# Altium schematic sheet Mixer.SchDoc
size B; SheetNumber: 3; SheetTotal: 8
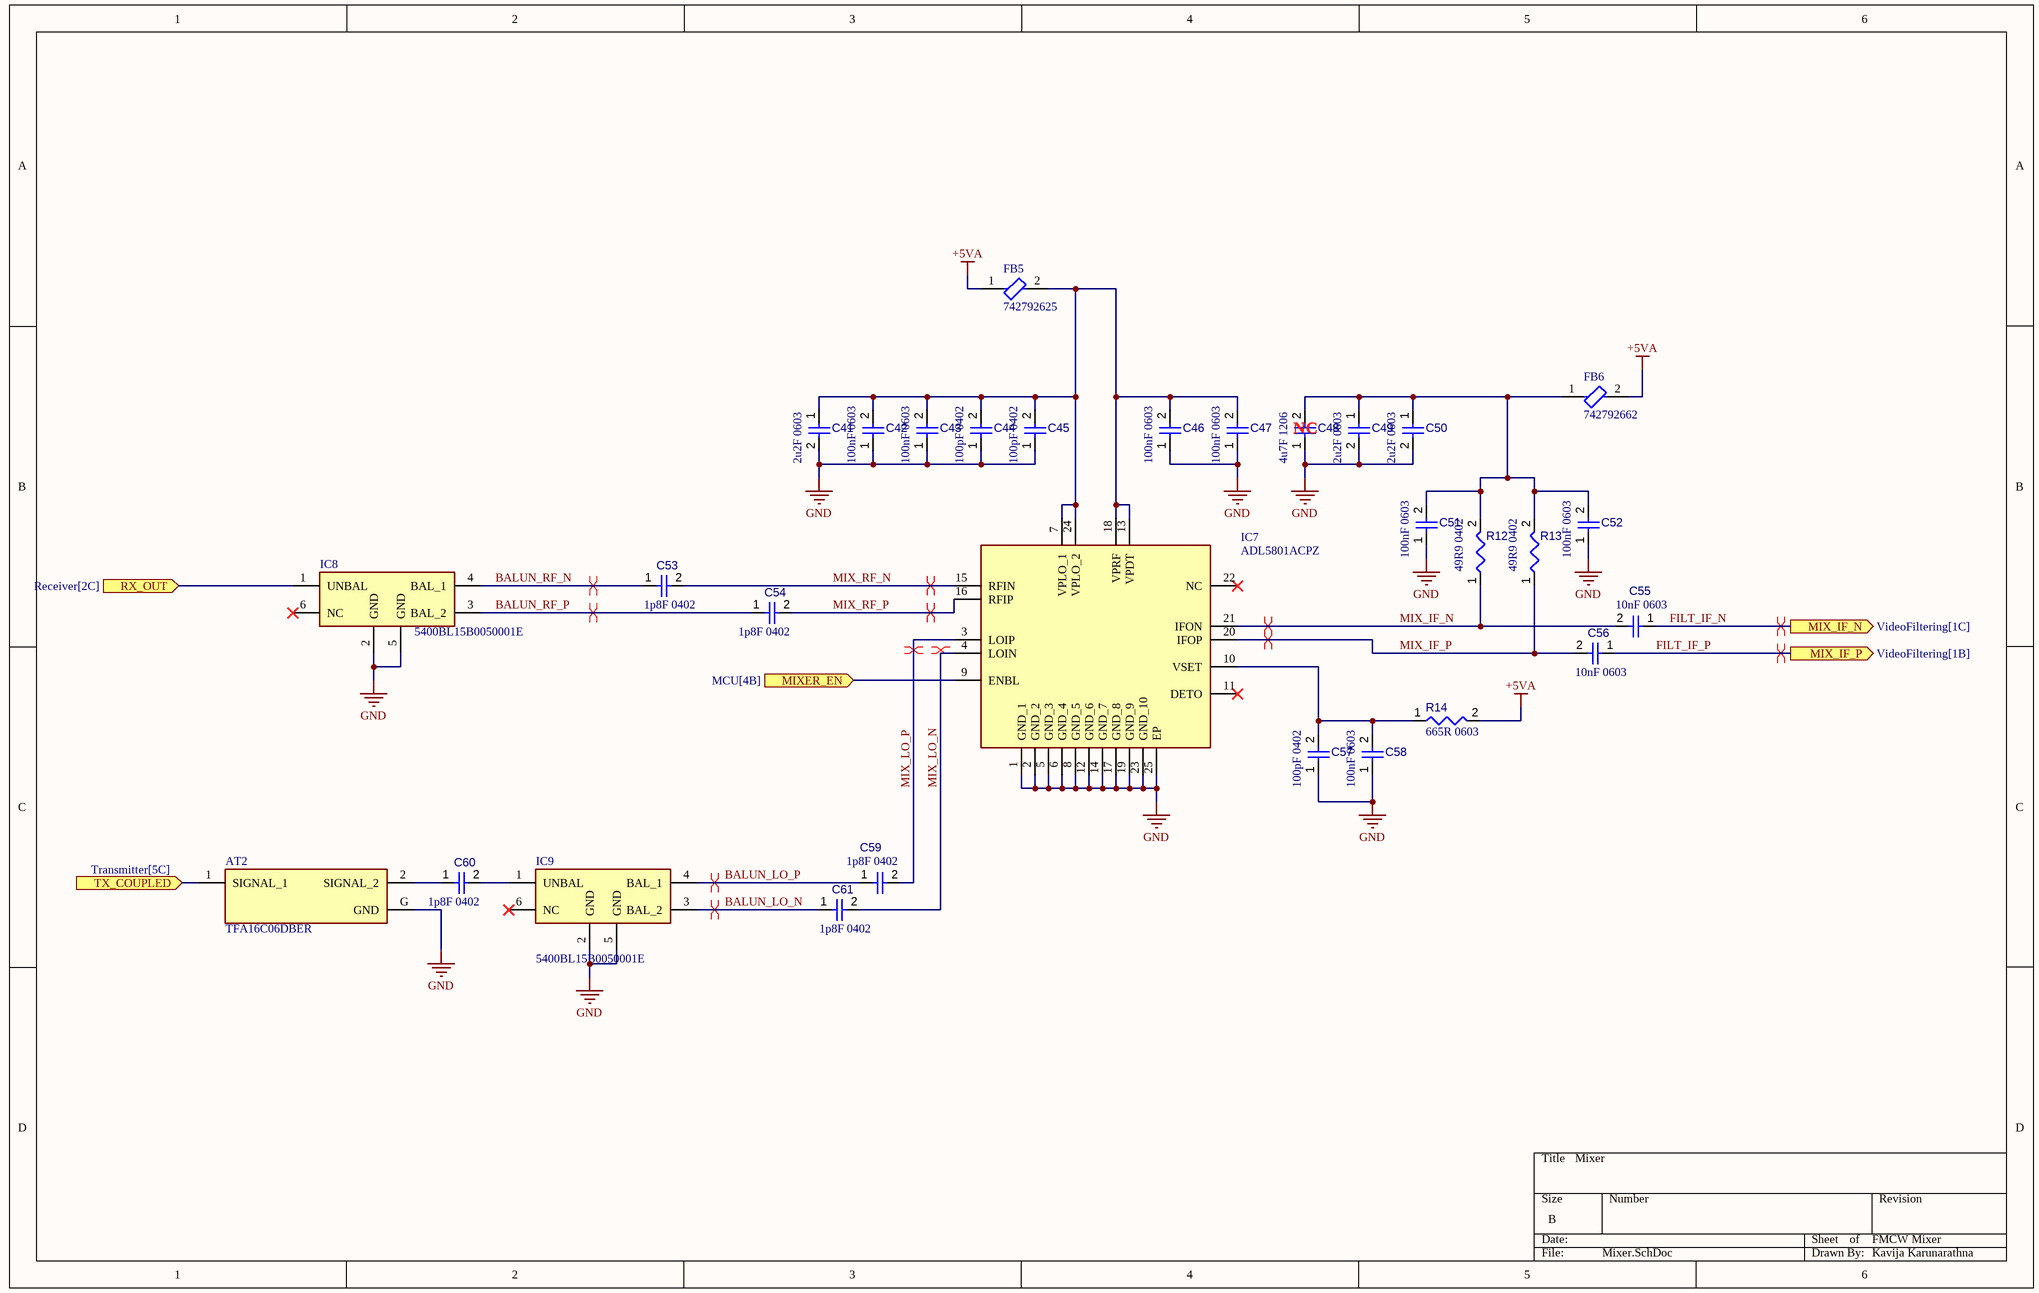
[diagram p0: Mixer.SchDoc]

## Parts
AT2  TFA16C06DBER  [ATTN_TFA16C06DBER]
C41  value 2u2F 0603  [CAPC0603(1608)100_L]  (hidden comment: Capacitor 1µF +/-0.1% 25V 0603)
C42  value 100nF 0603  [CAPC0603(1608)100_L]  (hidden comment: Capacitor 1µF +/-0.1% 25V 0603)
C43  value 100nF 0603  [CAPC0603(1608)100_L]  (hidden comment: Capacitor 1µF +/-0.1% 25V 0603)
C44  value 100pF 0402  [CAPC0402(1005)60_L]  (hidden comment: Capacitor 47nF +/-20% 50V 0402)
C45  value 100pF 0402  [CAPC0402(1005)60_L]  (hidden comment: Capacitor 47nF +/-20% 50V 0402)
C46  value 100nF 0603  [CAPC0603(1608)100_L]  (hidden comment: Capacitor 1µF +/-0.1% 25V 0603)
C47  value 100nF 0603  [CAPC0603(1608)100_L]  (hidden comment: Capacitor 1µF +/-0.1% 25V 0603)
C48  value 4u7F 1206  [CAPC3216X180X50NL20T25]  (hidden comment: Capacitor 4.7 uF +/- 10% 60 V 1206)
C49  value 2u2F 0603  [CAPC0603(1608)100_L]  (hidden comment: Capacitor 1µF +/-0.1% 25V 0603)
C50  value 2u2F 0603  [CAPC0603(1608)100_L]  (hidden comment: Capacitor 1µF +/-0.1% 25V 0603)
C51  value 100nF 0603  [CAPC0603(1608)100_L]  (hidden comment: Capacitor 1µF +/-0.1% 25V 0603)
C52  value 100nF 0603  [CAPC0603(1608)100_L]  (hidden comment: Capacitor 1µF +/-0.1% 25V 0603)
C53  value 1p8F 0402  [CAPC0402(1005)60_L]  (hidden comment: Capacitor 47nF +/-20% 50V 0402)
C54  value 1p8F 0402  [CAPC0402(1005)60_L]  (hidden comment: Capacitor 47nF +/-20% 50V 0402)
C55  value 10nF 0603  [CAPC0603(1608)100_L]  (hidden comment: Capacitor 82nF +/-0.1% 25V 0603)
C56  value 10nF 0603  [CAPC0603(1608)100_L]  (hidden comment: Capacitor 82nF +/-0.1% 25V 0603)
C57  value 100pF 0402  [CAPC0402(1005)60_L]  (hidden comment: Capacitor 47nF +/-20% 50V 0402)
C58  value 100nF 0603  [CAPC0603(1608)100_L]  (hidden comment: Capacitor 1µF +/-0.1% 25V 0603)
C59  value 1p8F 0402  [CAPC0402(1005)60_L]  (hidden comment: Capacitor 47nF +/-20% 50V 0402)
C60  value 1p8F 0402  [CAPC0402(1005)60_L]  (hidden comment: Capacitor 47nF +/-20% 50V 0402)
C61  value 1p8F 0402  [CAPC0402(1005)60_L]  (hidden comment: Capacitor 47nF +/-20% 50V 0402)
FB5  742792625  [FB-0603]
FB6  742792662  [FB-0603]
IC7  ADL5801ACPZ  [QFN50P400X400X100-25N-D]
IC8  5400BL15B0050001E  [5400BL15B0050001E]
IC9  5400BL15B0050001E  [5400BL15B0050001E]
R12  value 49R9 0402  [RESC0402(1005)_L]  (hidden comment: 383KR2F)
R13  value 49R9 0402  [RESC0402(1005)_L]  (hidden comment: 383KR2F)
R14  value 665R 0603  [RESC0603(1608)_L]  (hidden comment: 120R3J)

## Ports
MIX_IF_N (out, see VideoFiltering[1C]), MIX_IF_P (out, see VideoFiltering[1B]), MIXER_EN (in, see MCU[4B]), RX_OUT (in, see Receiver[2C]), TX_COUPLED (in, see Transmitter[5C])

## Nets
+5VA: FB5.1 FB6.2 R14.2
GND: AT2.G(GND) C41.2 C42.1 C43.1 C44.1 C45.1 C46.1 C47.1 C48.1 C49.2 C50.2 C51.1 C52.1 C57.1 C58.1 IC7.1(GND_1) IC7.2(GND_2) IC7.5(GND_3) IC7.6(GND_4) IC7.8(GND_5) IC7.12(GND_6) IC7.14(GND_7) IC7.17(GND_8) IC7.19(GND_9) IC7.23(GND_10) IC7.25(EP) IC8.2(GND) IC8.5(GND) IC9.2(GND) IC9.5(GND)
BALUN_LO_N: C61.1 IC9.3(BAL_2)
BALUN_LO_P: C59.1 IC9.4(BAL_1)
BALUN_RF_N: C53.1 IC8.4(BAL_1)
BALUN_RF_P: C54.1 IC8.3(BAL_2)
FILT_IF_N: C55.1 ; port MIX_IF_N
FILT_IF_P: C56.1 ; port MIX_IF_P
MIX_IF_N: C55.2 IC7.21(IFON) R12.1
MIX_IF_P: C56.2 IC7.20(IFOP) R13.1
MIX_LO_N: C61.2 IC7.4(LOIN)
MIX_LO_P: C59.2 IC7.3(LOIP)
MIX_RF_N: C53.2 IC7.15(RFIN)
MIX_RF_P: C54.2 IC7.16(RFIP)
MIXER_EN: IC7.9(ENBL) ; port MIXER_EN
RX_OUT: IC8.1(UNBAL) ; port RX_OUT
TX_COUPLED: AT2.1(SIGNAL_1) ; port TX_COUPLED
NetAT2_2: AT2.2(SIGNAL_2) C60.1
NetC41_1: C41.1 C42.2 C43.2 C44.2 C45.2 C46.2 C47.2 FB5.2 IC7.7(VPLO_1) IC7.13(VPDT) IC7.18(VPRF) IC7.24(VPLO_2)
NetC48_2: C48.2 C49.1 C50.1 C51.2 C52.2 FB6.1 R12.2 R13.2
NetC57_2: C57.2 C58.2 IC7.10(VSET) R14.1
NetC60_2: C60.2 IC9.1(UNBAL)

Not connected (* = marked no-connect by the designer): IC7 11(DETO)* 22(NC)*; IC8 6(NC)*; IC9 6(NC)*

## Layout directives
differential pair: BALUN_LO_N, BALUN_LO_P, BALUN_RF_N, BALUN_RF_P, FILT_IF_N, FILT_IF_P, MIX_IF_N, MIX_IF_P, MIX_LO_N, MIX_LO_P, MIX_RF_N, MIX_RF_P

## Notes on the sheet
- (near C48) NC
- Mixer
- FMCW Mixer
- Kavija Karunarathna

## Library data of the parts
AT2 = CMP-379-000000-3: RF ATTENUATOR0603 RF ATTENUATOR; Manufacturer Part No: TFA16C03DBER; MF: Ohmite; Design Item ID: TFA16C06DBER; Value: *; Check_prices: https://www.snapeda.com/parts/TFA16C06DBER/Ohmite/view-part/?ref=eda; SnapEDA_Link: https://www.snapeda.com/parts/TFA16C06DBER/Ohmite/view-part/?ref=snap; Component Type: Standard; Package: None; Source: TFA16C06DBER.SchLib; Pin Count: 3; Mouser Part No: 588-TFA16C03DBER
C41 C49 C50 = CMP-001-00055-4: Multilayer Ceramic Capacitors MLCC - SMD/SMT 0603 10nF 16volts X7R 10%; Manufacturer Part No: VJ0603G225KXQCW1BC; Tolerance: 20%; Min Operating Temperature: -55°C; Max Operating Temperature: 85°C; Voltage Rating: 25V; Mounting Technology: SMT; Case/Package: 0603; Pins: 2; Mouser Part No: 77-VJ0603G225KXQCWBC
C42 C43 C46 C47 C51 C52 C58 = CMP-001-00055-4: Chip Capacitor, 1µF +/-0.1%, 25V, 0603, Thickness 1 mm; Manufacturer Part No: 0603X104K250CT; Tolerance: 20%; Min Operating Temperature: -55°C; Max Operating Temperature: 85°C; Voltage Rating: 25V; Mounting Technology: SMT; Case/Package: 0603; Pins: 2; Mouser Part No: 791-0603X104K250CT
C44 C45 C57 = CMP-001-00071-4: Chip Capacitor, 47nF +/-20%, 50V, 0402, Thickness 0.6 mm; Manufacturer Part No: 0402X7R101KT2AT; Tolerance: 20%; Pins: 2; Mounting Technology: SMT; Voltage Rating: 50V; Case/Package: 0402; Max Operating Temperature: 85°C; Min Operating Temperature: -55°C; Mouser Part No: 581-0402X7R101KT2AT
C48 = CMP-001-00016-6: Multilayer Ceramic Capacitors MLCC - SMD/SMT 50V 4.7uF X7R 1206 10% HI CV; Manufacturer Part No: CC1206KFX7R9BB475; Tolerance: 10%; Min Operating Temperature: -55°C; Capacitor Type: Ceramic; Voltage Rating: 50V; Pins: 2; Mounting Technology: SM; Case/Package: 1206; Max Operating Temperature: 125°C; RoHS Compliant: True; Mouser Part No: 603-CC1206KFX7R9B475
C53 C54 C59-C61 = CMP-001-00071-4: Multilayer Ceramic Capacitors MLCC - SMD/SMT 50 V 10 pF C0G 0402 1%; Manufacturer Part No: GJM1555C1H1R8CB01J; Tolerance: 20%; Pins: 2; Mounting Technology: SMT; Voltage Rating: 50V; Case/Package: 0402; Max Operating Temperature: 85°C; Min Operating Temperature: -55°C; Mouser Part No: 81-GJM1555C1H1R8CB1J
C55 C56 = CMP-001-00055-4: Multilayer Ceramic Capacitors MLCC - SMD/SMT 25V 0.082uF X7R 0603 5%; Manufacturer Part No: C0603C823J3RACTU; Tolerance: 20%; Min Operating Temperature: -55°C; Max Operating Temperature: 85°C; Voltage Rating: 25V; Mounting Technology: SMT; Case/Package: 0603; Pins: 2; Mouser Part No: 80-C0603C823J3R
FB5 = 742792662-FB: FERRITE BEAD 0603; Max Current Rating: 2000mA; DC Resistance (DCR): 1000Ohm; Number of Lines: 1; Case/Package: 0603; Mount: Surface Mount; Case Code (Imperial): 0603; Packaging: Cut Tape; Max Operating Temperature: 125°C; Min Operating Temperature: -55°C; Manufacturer Part No: 742792625; Mouser Part No: 710-742792625
FB6 = 742792662-FB: FERRITE BEAD 0603; Max Current Rating: 600mA; DC Resistance (DCR): 1000Ohm; Number of Lines: 1; Case/Package: 0603; Mount: Surface Mount; Case Code (Imperial): 0603; Packaging: Cut Tape; Max Operating Temperature: 125°C; Min Operating Temperature: -55°C; Manufacturer Part No: 742792662; Mouser Part No: 710-742792662
IC7 = ADL5801ACPZ: Integrated Circuit; Manufacturer_Name: Analog Devices; Manufacturer Part No: ADL5801ACPZ-R7; Datasheet Link: https://g.componentsearchengine.com/Datasheets/2/ADL5801ACPZ.pdf; Height: 1mm; Mouser Part No: 584-ADL5801ACPZ-R7; Mouser Price/Stock: https://www.mouser.co.uk/ProductDetail/Analog-Devices/ADL5801ACPZ?qs=%252BEew9%252B0nqrBhhLLfUJ8blg%3D%3D
IC8 IC9 = 5400BL15B0050001E: Integrated Circuit; Manufacturer_Name: ANAREN; Datasheet Link: https://cdn.anaren.com/product-documents/Xinger/PowerDividers/PD6080J5050S2HF/PD6080J5050S2HF_DataSheet(Rev_B).pdf; Height: 0.48mm; Manufacturer Part No: 5400BL15B0050001E; Mouser Part No: 609-5400BL15B0050001; Mouser Price/Stock: https://www.mouser.com/Search/Refine.aspx?Keyword=620-PD6080J5050S2HF
R12 R13 = CMP-009-00097-2: Thin Film Resistors - SMD 49.9 OHM .1% 50PPM 1/16W; Manufacturer Part No: RT0402BRE0749R9L; Tolerance: 1%; Power: 100mW; Case/Package: 0402; Mounting Technology: SMT; Pins: 2; Mouser Part No: 603-RT0402BRE0749R9L
R14 = CMP-009-00069-2: Thick Film Resistors - SMD General Purpose Chip Resistor 0603, 200Ohms, 1%, 1/10W; Manufacturer Part No: RT0603BRD07665RL; Power: 100mW; Tolerance: 5%; Mounting Technology: SMT; Case/Package: 0603; Pins: 2; Mouser Part No: 603-RT0603BRD07665RL